# EAGLE schematic Tractive System Diagram - Outside of Accumulator - 2 segments (EAGLE 8.1.0)
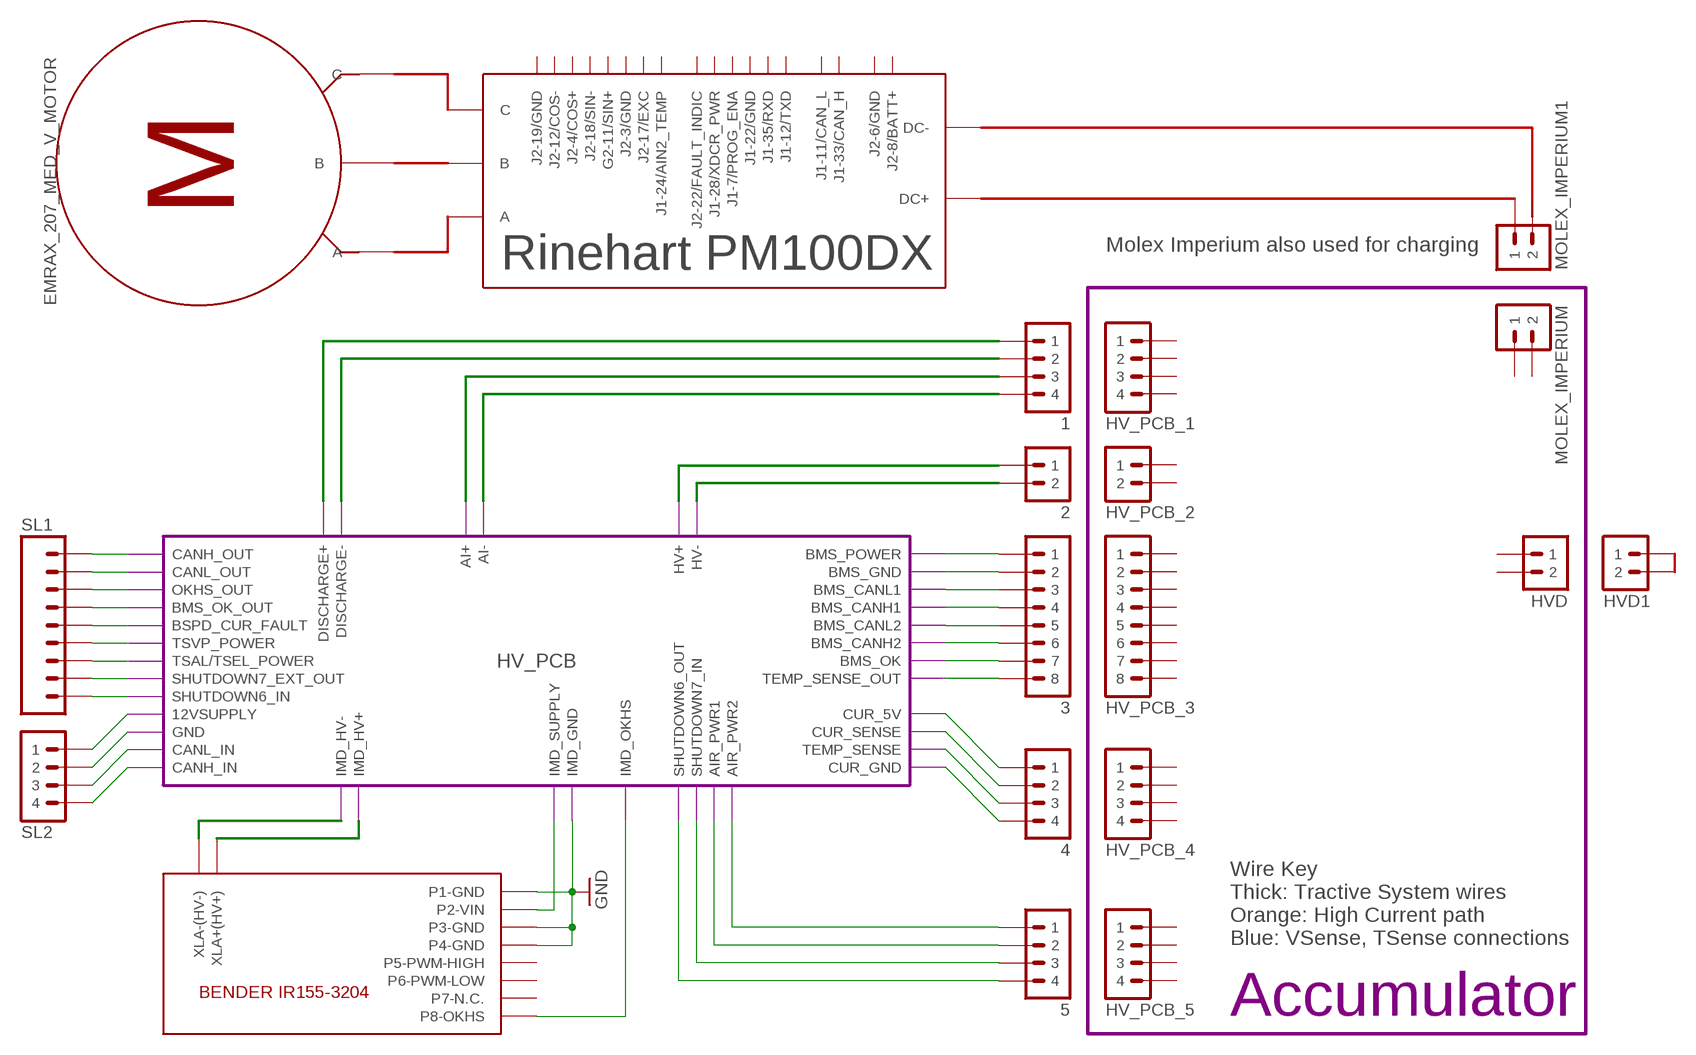
[diagram p0: schematic, sheet 1]

## Parts
1  M04  (no package)
2  M02  (no package)
3  M08  (no package)
4  M04  (no package)
5  M04  (no package)
EMRAX_207_MED_V_MOTOR  MOTOR_AC  (no package)
HV_PCB_1  M04  (no package)
HV_PCB_2  M02  (no package)
HV_PCB_3  M08  (no package)
HV_PCB_4  M04  (no package)
HV_PCB_5  M04  (no package)
HVD  M02  (no package)
HVD1  M02  (no package)
MOLEX_IMPERIUM  M02  (no package)
MOLEX_IMPERIUM1  M02  (no package)
SL1  M09  (no package)
SL2  M04  (no package)
U$2  RINEHART_PM100DX  (no package)
U$4  BENDER_IR155-3204  (no package)

## Module instances
HV_PCB = HV_ECU

## Nets
GND: U$4.P1-GND U$4.P3-GND U$4.P4-GND ; port HV_PCB.IMD_GND
N$1: 4.3 ; port HV_PCB.TEMP_SENSE
N$2: 5.4 ; port HV_PCB.SHUTDOWN6_OUT
N$3: 3.1 ; port HV_PCB.BMS_POWER
N$4: 5.3 ; port HV_PCB.SHUTDOWN7_IN
N$5: 5.2 ; port HV_PCB.AIR_PWR1
N$6: 5.1 ; port HV_PCB.AIR_PWR2
N$7: 2.2 ; port HV_PCB.HV-
N$8: 2.1 ; port HV_PCB.HV+
N$9: 1.3 ; port HV_PCB.AI+
N$10: U$4.XLA-(HV-) ; port HV_PCB.IMD_HV-
N$11: 1.1 ; port HV_PCB.DISCHARGE+
N$12: U$4.XLA+(HV+) ; port HV_PCB.IMD_HV+
N$15: 3.2 ; port HV_PCB.BMS_GND
N$18: 1.4 ; port HV_PCB.AI-
N$19: 3.3 ; port HV_PCB.BMS_CANL1
N$23: SL1.1 ; port HV_PCB.SHUTDOWN6_IN
N$25: SL1.2 ; port HV_PCB.SHUTDOWN7_EXT_OUT
N$26: SL1.3 ; port HV_PCB.TSAL/TSEL_POWER
N$27: SL1.4 ; port HV_PCB.TSVP_POWER
N$28: SL1.5 ; port HV_PCB.BSPD_CUR_FAULT
N$29: SL1.6 ; port HV_PCB.BMS_OK_OUT
N$30: SL1.7 ; port HV_PCB.OKHS_OUT
N$31: 3.4 ; port HV_PCB.BMS_CANH1
N$32: U$4.P2-VIN ; port HV_PCB.IMD_SUPPLY
N$33: SL1.8 ; port HV_PCB.CANL_OUT
N$34: U$4.P8-OKHS ; port HV_PCB.IMD_OKHS
N$37: SL1.9 ; port HV_PCB.CANH_OUT
N$38: 1.2 ; port HV_PCB.DISCHARGE-
N$40: 3.5 ; port HV_PCB.BMS_CANL2
N$41: 3.6 ; port HV_PCB.BMS_CANH2
N$42: 3.8 ; port HV_PCB.TEMP_SENSE_OUT
N$43: SL2.1 ; port HV_PCB.12VSUPPLY
N$44: SL2.2 ; port HV_PCB.GND
N$45: SL2.3 ; port HV_PCB.CANL_IN
N$46: SL2.4 ; port HV_PCB.CANH_IN
N$47: 4.4 ; port HV_PCB.CUR_GND
N$49: 4.2 ; port HV_PCB.CUR_SENSE
N$50: 4.1 ; port HV_PCB.CUR_5V
N$54: 3.7 ; port HV_PCB.BMS_OK
Unconnected: EMRAX_207_MED_V_MOTOR.A EMRAX_207_MED_V_MOTOR.B EMRAX_207_MED_V_MOTOR.C HV_PCB_1.1 HV_PCB_1.2 HV_PCB_1.3 HV_PCB_1.4 HV_PCB_2.1 HV_PCB_2.2 HV_PCB_3.1 HV_PCB_3.2 HV_PCB_3.3 HV_PCB_3.4 HV_PCB_3.5 HV_PCB_3.6 HV_PCB_3.7 HV_PCB_3.8 HV_PCB_4.1 HV_PCB_4.2 HV_PCB_4.3 HV_PCB_4.4 HV_PCB_5.1 HV_PCB_5.2 HV_PCB_5.3 HV_PCB_5.4 HVD1.1 HVD1.2 HVD.1 HVD.2 MOLEX_IMPERIUM1.1 MOLEX_IMPERIUM1.2 MOLEX_IMPERIUM.1 MOLEX_IMPERIUM.2 U$2.A U$2.B U$2.C U$2.DC+ U$2.DC- U$2.G2-11/SIN+ U$2.J1-7/PROG_ENA U$2.J1-11/CAN_L U$2.J1-12/TXD U$2.J1-22/GND U$2.J1-24/AIN2_TEMP U$2.J1-28/XDCR_PWR U$2.J1-33/CAN_H U$2.J1-35/RXD U$2.J2-3/GND U$2.J2-4/COS+ U$2.J2-6/GND U$2.J2-8/BATT+ U$2.J2-12/COS- U$2.J2-17/EXC U$2.J2-18/SIN- U$2.J2-19/GND U$2.J2-22/FAULT_INDIC U$4.P5-PWM-HIGH U$4.P6-PWM-LOW U$4.P7-N.C.

## Notes on the sheet
- Molex Imperium also used for charging
- Wire Key
  Thick: Tractive System wires
  Orange: High Current path
  Blue: VSense, TSense connections
- Accumulator

## Library data of the parts
1 4 5 HV_PCB_1 HV_PCB_4 HV_PCB_5 SL2 = HyTechSymbols:M04: Generic 4-pin connector
2 HV_PCB_2 HVD HVD1 MOLEX_IMPERIUM MOLEX_IMPERIUM1 = HyTechSymbols:M02: Generic 2-pin connector
3 HV_PCB_3 = HyTechSymbols:M08: Generic 8-pin connector
EMRAX_207_MED_V_MOTOR = HyTechSymbols:MOTOR_AC: Generic three-phase AC electric motor
SL1 = HyTechSymbols:M09: Generic 9-pin connector
U$2 = HyTechSymbols:RINEHART_PM100DX: Rinehart Motion Systems PM100DX Motor Inverter Product Page <http://www.rinehartmotion.com/standard.html> Datasheet <http://www.rinehartmotion.com/uploads/5/1/3/0/51309945/pm100-150datasheet_2.pdf>
U$4 = HyTechSymbols:BENDER_IR155-3204: Bender IR155-3204 Insulation Monitoring Device Datasheet <http://www.bender-es.com/fileadmin/products/doc/IR155-32xx-V004_D00115_D_XXEN.pdf>

## Module HV_ECU
Ports: TSVP_POWER(out) TSAL/TSEL_POWER(out) BSPD_CUR_FAULT(out) HV+(pas) HV-(pas) AI-(in) AI+(out) BMS_POWER(out) IMD_GND(out) OKHS_OUT(out) IMD_OKHS(in) BMS_GND(in) IMD_HV+(nc) IMD_HV-(nc) SHUTDOWN6_OUT(out) SHUTDOWN6_IN(in) SHUTDOWN7_EXT_OUT(out) BMS_OK_OUT(out) CANL_OUT(io) CANH_OUT(io) AIR_PWR1(out) AIR_PWR2(out) SHUTDOWN7_IN(in) DISCHARGE-(in) DISCHARGE+(out) BMS_CANL1(io) BMS_CANH1(io) BMS_CANL2(io) BMS_CANH2(io) TEMP_SENSE_OUT(out) IMD_SUPPLY(out) 12VSUPPLY(in) GND(out) CANL_IN(io) CANH_IN(io) CUR_SENSE(in) CUR_GND(in) CUR_5V(out) TEMP_SENSE(in) BMS_OK(in)

### Library data of the parts

## Module AMS_SEGMENT
Ports: ISOSPI1(io) ISOSPI2(io) ISOSPI3(io) ISOSPI4(io)

### Library data of the parts

## Module AMS_CONTROL
Ports: ISOSPI2(io) ISOSPI1(io) GND(out) POWER(in) CANL1(io) CANL2(io) CANH1(io) CANH2(io) TEMP_SENSE(in) BMS_OK(out)

### Library data of the parts

## Module BSPD_SENSE
Ports: GND(out) TEMP(out) CUR(out) 5V(in)

### Library data of the parts

## Module FSAE_ENERGY_METER
Ports: HV-OUT(nc) HV+OUT(nc) HV-IN(nc) HV+IN(nc) 12V+(in) GND(out)

### Library data of the parts